# Altium schematic sheet HnWrist_ExtendBoard.SchDoc
size A4
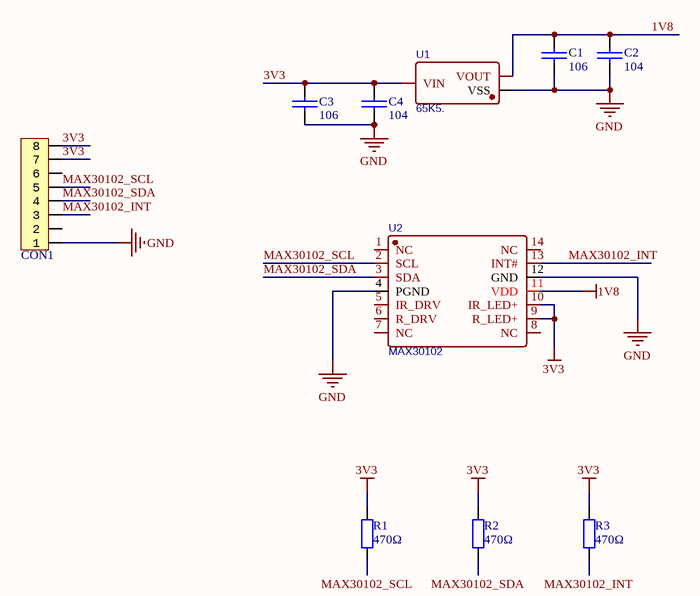
[diagram p0: HnWrist_ExtendBoard.SchDoc]

## Parts
C1  106  [0603C]
C2  104  [0603C]
C3  106  [0603C]
C4  104  [0603C]
CON1  FFC_0.5_8  [FFC_0.5_8]  (value not drawn)
R1  470Ω  [LC-0603_R]
R2  470Ω  [LC-0603_R]
R3  470Ω  [LC-0603_R]
U1  65K5.  [SOT-23-3_L2.9-W1.3-P1.90-LS2.4-BR]
U2  MAX30102  [SENSOR-SMD_MAX30102]

## Nets
1V8: C1.2 C2.2 U1.2(VOUT) U2.11(VDD)
3V3: C3.2 C4.2 CON1.7 CON1.8 R1.2 R2.1 R3.1 U1.3(VIN) U2.9(R_LED+) U2.10(IR_LED+)
GND: C1.1 C2.1 C3.1 C4.1 CON1.1 U1.1(VSS) U2.4(PGND) U2.12(GND)
MAX30102_INT: CON1.3 R3.2 U2.13(INT#)
MAX30102_SCL: CON1.5 R1.1 U2.2(SCL)
MAX30102_SDA: CON1.4 R2.2 U2.3(SDA)

Not connected (* = marked no-connect by the designer): CON1 2 6; U2 1(NC) 5(IR_DRV) 6(R_DRV) 7(NC) 8(NC) 14(NC)

## Notes on the sheet
- Title
- Size:
- Date:
- A4
- Number:
- Time:
- Revision:
- Sheet
- of
- File:

## Library data of the parts
C1-C4 = CAP: 无极性电容
CON1 = FFC_0.5_8: FFC; System: Connector
R1-R3 = 0603 470Ω (4700) 1%: 贴片电阻; ComponentLink1Description: 供应商链接; ComponentLink1URL: http://www.szlcsc.com/product/details_23906.html; Package: 0603; Supplier: LC; SuppliersPartNumber: C23179
U1 = 65K5.: BOM_Manufacturer: Shenzhen Fuman Elec; Contributor: LCSC; BOM_Supplier: LCSC; BOM_Supplier Part: C841299; BOM_Manufacturer Part: 65K5.; BOM_JLCPCB Part Class: Extended Part; spicePre: U; spiceSymbolName: 65K5.
U2 = MAX30102: 血氧心率芯片; BOM_Manufacturer: MAXIM; BOM_Manufacturer Part: MAX30100EFD+; BOM_Supplier: LCSC; BOM_Supplier Part: C92512; BOM_JLCPCB Part Class: Extended Part; spicePre: U; spiceSymbolName: MAX30100EFD+